# Altium schematic sheet 05_MCU.SchDoc: =TitleParameter
size A3; Organization: ASISGUARD; Address1: Kemalpasa, Kemalpasa Cd. No:290 D:292H, 35060 Bornova/Izmir/Turkey; SheetNumber: 5; SheetTotal: 6
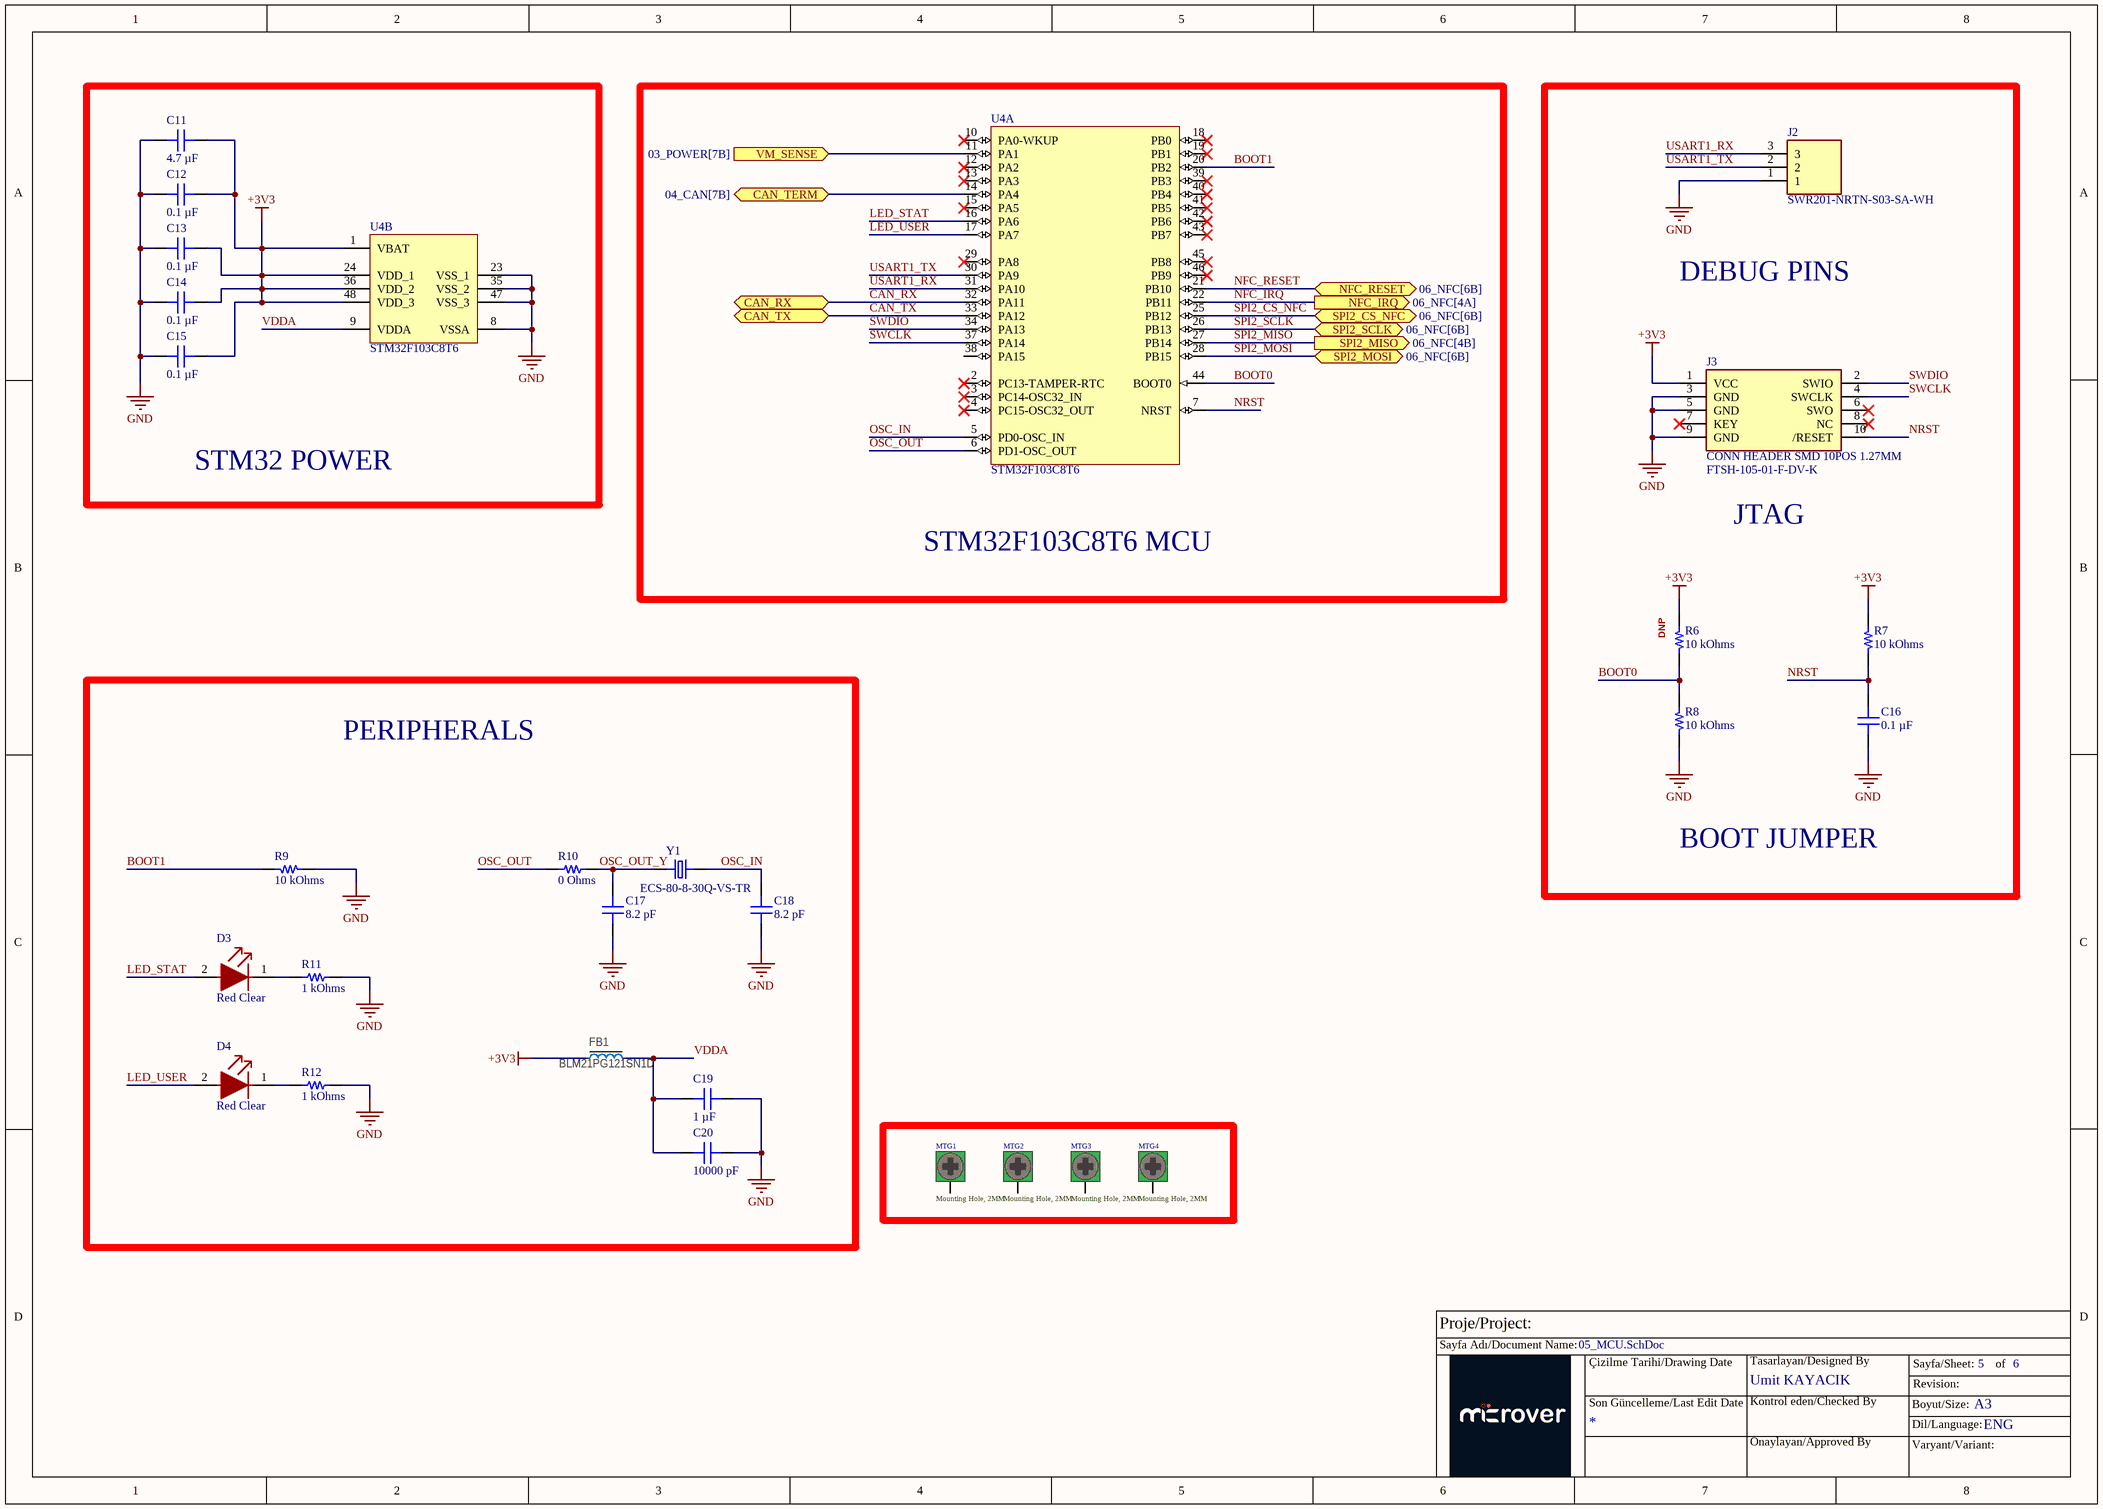
[diagram p0: 05_MCU.SchDoc]

## Parts
C11  4.7 µF  [CAP 0805_2012]
C12  Capacitance: 0.1 µF  [CAP 0603_1608]  (hidden comment: GCM188R71H104KA57J)
C13  Capacitance: 0.1 µF  [CAP 0603_1608]  (hidden comment: GCM188R71H104KA57J)
C14  Capacitance: 0.1 µF  [CAP 0603_1608]  (hidden comment: GCM188R71H104KA57J)
C15  Capacitance: 0.1 µF  [CAP 0603_1608]  (hidden comment: GCM188R71H104KA57J)
C16  Capacitance: 0.1 µF  [CAP 0603_1608]  (hidden comment: GCM188R71H104KA57J)
C17  8.2 pF  [CAP 0402_1005]
C18  8.2 pF  [CAP 0402_1005]
C19  1 µF  [CAP 0603_1608]
C20  10000 pF  [CAP 0603_1608]
D3  Color: Red Clear  [Lite-On_RED_0603]  (hidden comment: LED RED CLEAR SMD)
D4  Color: Red Clear  [Lite-On_RED_0603]  (hidden comment: LED RED CLEAR SMD)
FB1  BLM21PG121SN1D  [INDC2012X11L]
J2  SWR201-NRTN-S03-SA-WH  [SHDR3W50P0X200_1X3_790X460X630P]
J3  CONN HEADER SMD 10POS 1.27MM  [Samtec_0_MFG]
MTG1  Mounting Hole, 2MM  [MTG-PTH-2MM]  (no BOM)
MTG2  Mounting Hole, 2MM  [MTG-PTH-2MM]  (no BOM)
MTG3  Mounting Hole, 2MM  [MTG-PTH-2MM]  (no BOM)
MTG4  Mounting Hole, 2MM  [MTG-PTH-2MM]  (no BOM)
R6  10 kOhms  [RES 0402_1005]
R7  10 kOhms  [RES 0402_1005]
R8  10 kOhms  [RES 0402_1005]
R9  10 kOhms  [RES 0402_1005]
R10  0 Ohms  [RES 0402_1005]
R11  1 kOhms  [RES 0402_1005]
R12  1 kOhms  [RES 0402_1005]
U4  STM32F103C8T6  [LQFP48_STM]  (parts A,B of 2)
Y1  ECS-80-8-30Q-VS-TR  [XTAL_ECS-80-8-30Q-VS-TR]

## Blocks framed on the sheet
STM32 POWER: C11-C15 U4
STM32F103C8T6 MCU: U4
PERIPHERALS: C17-C20 D3 D4 FB1 R9-R12 Y1

## Ports
CAN_RX (bidir, see 04_CAN[2B]), CAN_TERM (bidir, see 04_CAN[7B]), CAN_TX (bidir, see 04_CAN[2B]), NFC_IRQ (out, see 06_NFC[4A]), NFC_RESET (bidir, see 06_NFC[6B]), SPI2_CS_NFC (bidir, see 06_NFC[6B]), SPI2_MISO (out, see 06_NFC[4B]), SPI2_MOSI (bidir, see 06_NFC[6B]), SPI2_SCLK (bidir, see 06_NFC[6B]), VM_SENSE (in, see 03_POWER[7B])

## Nets
+3V3: C11.2 C12.1 C13.1 C14.1 C15.1 FB1.1 J3.1(VCC) R6.1 R7.1 U4.1(VBAT) U4.24(VDD_1) U4.36(VDD_2) U4.48(VDD_3)
GND: C11.1 C12.2 C13.2 C14.2 C15.2 C16.2 C17.1 C18.1 C19.2 C20.2 J2.1 J3.3(GND) J3.5(GND) J3.9(GND) R8.2 R9.1 R11.2 R12.2 U4.8(VSSA) U4.23(VSS_1) U4.35(VSS_2) U4.47(VSS_3)
BOOT0: R6.2 R8.1 U4.44(BOOT0)
BOOT1: R9.2 U4.20(PB2)
CAN_RX: U4.32(PA11) ; port CAN_RX
CAN_TERM: U4.14(PA4) ; port CAN_TERM
CAN_TX: U4.33(PA12) ; port CAN_TX
LED_STAT: D3.2(A) U4.16(PA6)
LED_USER: D4.2(A) U4.17(PA7)
NFC_IRQ: U4.22(PB11) ; port NFC_IRQ
NFC_RESET: U4.21(PB10) ; port NFC_RESET
NRST: C16.1 J3.10(/RESET) R7.2 U4.7(NRST)
OSC_IN: C18.2 U4.5(PD0-OSC_IN) Y1.2(OUT/IN)
OSC_OUT: R10.1 U4.6(PD1-OSC_OUT)
OSC_OUT_Y: C17.2 R10.2 Y1.1(IN/OUT)
SPI2_CS_NFC: U4.25(PB12) ; port SPI2_CS_NFC
SPI2_MISO: U4.27(PB14) ; port SPI2_MISO
SPI2_MOSI: U4.28(PB15) ; port SPI2_MOSI
SPI2_SCLK: U4.26(PB13) ; port SPI2_SCLK
SWCLK: J3.4(SWCLK) U4.37(PA14)
SWDIO: J3.2(SWIO) U4.34(PA13)
USART1_RX: J2.3 U4.31(PA10)
USART1_TX: J2.2 U4.30(PA9)
VDDA: C19.1 C20.1 FB1.2 U4.9(VDDA)
VM_SENSE: U4.11(PA1) ; port VM_SENSE
NetD3_1: D3.1(C) R11.1
NetD4_1: D4.1(C) R12.1

Not connected (* = marked no-connect by the designer): J3 6(SWO)* 7(KEY)* 8(NC)*; MTG1 0; MTG2 0; MTG3 0; MTG4 0; U4 2(PC13-TAMPER-RTC)* 3(PC14-OSC32_IN)* 4(PC15-OSC32_OUT)* 10(PA0-WKUP)* 12(PA2)* 13(PA3)* 15(PA5)* 18(PB0)* 19(PB1)* 29(PA8)* 38(PA15) 39(PB3)* 40(PB4)* 41(PB5)* 42(PB6)* 43(PB7)* 45(PB8)* 46(PB9)*

## Notes on the sheet
- DEBUG PINS
- JTAG
- (near R6) DNP
- BOOT JUMPER
- Proje/Project:
- Sayfa Adı/Document Name:
- Çizilme Tarihi/Drawing Date
- Umit KAYACIK
- Tasarlayan/Designed By
- Sayfa/Sheet:
- Revision:
- of
- Son Güncelleme/Last Edit Date
- Kontrol eden/Checked By
- Onaylayan/Approved By
- Boyut/Size:
- Varyant/Variant:
- Dil/Language:
- A3
- ENG

## Library data of the parts
C11 = GRM21BZ71H475KE15K: CAP CER 4.7UF 50V X7R 0805; manufacturer: Murata Electronics; Tolerance: ±10%; Part Number: GRM21BZ71H475KE15K; Capacitance: 4.7 µF; Applications: General Purpose; componentlink1description: Datasheet; componentlink1url: https://search.murata.co.jp/Ceramy/image/img/A01X/G101/ENG/GRM21BZ71H475KE15-01.pdf; componentlink2description: DigiKey Link; componentlink2url: https://www.digikey.com/en/products/detail/murata-electronics/GRM21BZ71H475KE15K/13904908; Device Package: 0805 (2012 Metric); lastupdated: 6.04.2026 19:31:51; Lifecycle Status: Active; Minimum Order: 1; Mounting Type: Surface Mount, MLCC; Operating Temperature: -55°C ~ 125°C; Package / Case: 0805 (2012 Metric); packaging: TapeAndReel; partid: 39591; Part Status: Active; price: 0.17; series: GRM; Size / Dimension: 0.079" L x 0.049" W (2.00mm x 1.25mm); Supplier 1: DigiKey; Supplier Part Number 1: 490-GRM21BZ71H475KE15KCT-ND; Temperature Coefficient: X7R; Thickness (Max): 0.057" (1.45mm); value: 4.7 µF; Voltage - Rated: 50V
C12-C16 = GCM188R71H104KA57J: CAP CER 0.1UF 50V X7R 0603; manufacturer: Murata Electronics; Tolerance: ±10%; Part Number: GCM188R71H104KA57J; Applications: Automotive; componentlink1description: Datasheet; componentlink1url: https://psearch.en.murata.com/capacitor/product/GCM188R71H104KA57%23.pdf; componentlink2description: DigiKey Link; componentlink2url: https://www.digikey.com/en/products/detail/murata-electronics/GCM188R71H104KA57J/2591942; Device Package: 0603 (1608 Metric); lastupdated: 6.04.2026 19:22:36; Lifecycle Status: Active; Minimum Order: 1; Mounting Type: Surface Mount, MLCC; Operating Temperature: -55°C ~ 125°C; Package / Case: 0603 (1608 Metric); packaging: TapeAndReel; partid: 60442; Part Status: Not For New Designs; price: 0.03; Ratings: AEC-Q200; series: GCM; Size / Dimension: 0.063" L x 0.031" W (1.60mm x 0.80mm); Supplier 1: DigiKey; Supplier Part Number 1: 490-8020-1-ND; Temperature Coefficient: X7R; Thickness (Max): 0.035" (0.90mm); Voltage - Rated: 50V
C17 C18 = GMC04CG8R2J25NT: CAP0402 COG 8.2PF 5% 25V; manufacturer: Cal-Chip Electronics, Inc.; Temperature Coefficient: C0G, NP0; Part Number: GMC04CG8R2J25NT; Capacitance: 8.2 pF; Applications: General Purpose; componentlink1description: Datasheet; componentlink1url: https://calchip.com/wp-content/uploads/2025/05/GMC-Series-3.pdf; componentlink2description: DigiKey Link; componentlink2url: https://www.digikey.com/en/products/detail/cal-chip-electronics-inc/GMC04CG8R2J25NT/27784357; Device Package: 0402 (1005 Metric); Features: General Purpose; lastupdated: 6.04.2026 19:06:51; Lifecycle Status: Active; Minimum Order: 1; Mounting Type: Surface Mount, MLCC; Operating Temperature: -55°C ~ 125°C; Package / Case: 0402 (1005 Metric); packaging: TapeAndReel; partid: 61382; price: 0.07; series: GMC; Size / Dimension: 0.039" L x 0.020" W (1.00mm x 0.50mm); Supplier 1: DigiKey; Supplier Part Number 1: 4713-GMC04CG8R2J25NTCT-ND; Thickness (Max): 0.022" (0.55mm); Tolerance: ±5%; value: 8.2 pF; Voltage - Rated: 25V
C19 = GMC10X7R105K25NT: CAP0603 X7R 1UF 10% 25V; manufacturer: Cal-Chip Electronics, Inc.; Part Number: GMC10X7R105K25NT; Capacitance: 1 µF; Applications: General Purpose; componentlink1description: Datasheet; componentlink1url: https://calchip.com/wp-content/uploads/2023/05/gmc_series.pdf; componentlink2description: DigiKey Link; componentlink2url: https://www.digikey.com/en/products/detail/cal-chip-electronics-inc/GMC10X7R105K25NT/22461338; Device Package: 0603 (1608 Metric); lastupdated: 6.04.2026 19:18:33; Lifecycle Status: Active; Minimum Order: 1; Mounting Type: Surface Mount, MLCC; Operating Temperature: -55°C ~ 125°C; Package / Case: 0603 (1608 Metric); packaging: TapeAndReel; partid: 68086; price: 0.01; series: GMC; Size / Dimension: 0.063" L x 0.031" W (1.60mm x 0.80mm); Supplier 1: DigiKey; Supplier Part Number 1: 4713-GMC10X7R105K25NTCT-ND; Temperature Coefficient: X7R; Thickness (Max): 0.037" (0.95mm); Tolerance: ±10%; value: 1 µF; Voltage - Rated: 25V
C20 = C0603C103K4RECTU: CAP CER 0603 10NF 16V X7R 10%; manufacturer: KEMET; Part Number: C0603C103K4RECTU; Capacitance: 10000 pF; Applications: ESD Protection; componentlink1description: Datasheet; componentlink1url: https://search.kemet.com/download/datasheet/C0603C103K4REC7867; componentlink2description: DigiKey Link; componentlink2url: https://www.digikey.com/en/products/detail/kemet/C0603C103K4RECTU/8643658; Device Package: 0603 (1608 Metric); lastupdated: 6.04.2026 19:17:55; Lifecycle Status: Active; Minimum Order: 1; Mounting Type: Surface Mount, MLCC; Operating Temperature: -55°C ~ 125°C; Package / Case: 0603 (1608 Metric); packaging: TapeAndReel; partid: 66152; price: 0.01; series: ESD SMD Comm X7R; Size / Dimension: 0.063" L x 0.031" W (1.60mm x 0.80mm); Supplier 1: DigiKey; Supplier Part Number 1: 399-C0603C103K4RECTUCT-ND; Temperature Coefficient: X7R; Thickness (Max): 0.034" (0.87mm); Tolerance: ±10%; value: 10000 pF; Voltage - Rated: 16V
D3 D4 = LTST-C191KRKT_2: Red 631nm LED Indication - Discrete 2V 0603 (1608 Metric); Manufacturer: Lite-On Inc.; Order Code: DIGI: 160-1447-2-ND; Manufacturer Part Number: LTST-C191KRKT
FB1 = FB0402-120R@100M-500mA: Ferrite Bead, 120 Ohm @ 100MHz, 500mA, 250 mOhm Max; Manufacturer: Murata; Manufacturer Part Number: BLM15AG121SN1D; Part number IPS: 00000009954; Part number Norautron: 265230631; Part number NEMS: 100300099; Value: 120R/0.55A; Note: Chip EMIFIL Inductor Type Chip Ferrite Bead; Artikkelnr Noca: 33029317; Pad Count: 2; Component Status: Active; Part Number: FB0402-120R@100M-500mA; Footprint Doc: 0402; LatestRevisionDate: 2014-01-10; Published: 2011-11-14; ComponentLink1Description: Datasheet; ComponentLink2Description: Supplier link; ComponentLink1URL: N.A.; ComponentLink2URL: N.A.; HelpURL: http://search.murata.co.jp/Ceramy/image/img/PDF/ENG/L0110S0100BLM15A_SN.pdf; Supplier 1: Digi-Key; Supplier Part Number 1: 490-1005-1-ND; Supplier 2: Farnell; Supplier Part Number 2: 151-5760; Component Class: Inductors; PartId: 100300099; Author: rsk
J2 = SWR201-NRTN-S03-SA-WH: Connector; Manufacturer_Name: Sullins; Datasheet Link: https://drawings-pdf.s3.amazonaws.com/11623.pdf; Height: 6.3mm; Manufacturer_Part_Number: SWR201-NRTN-S03-SA-WH
J3 = FTSH-105-01-F-DV-K: Connector Header Surface Mount 10 position 0.050" (1.27mm); Order Code: DIGI: SAM8796-ND; Manufacturer Part Number: FTSH-105-01-F-DV-K
MTG1-MTG4 = MTG2MM
R6-R9 = RMCF0402FT10K0: RES 10K OHM 1% 1/16W 0402; Manufacturer: Stackpole Electronics Inc; Power (Watts): 0.063W, 1/16W; Temperature Coefficient: ±100ppm/°C; Part Number: RMCF0402FT10K0; Value: 10 kOhms; ComponentLink1Description: Datasheet; ComponentLink1URL: https://www.seielect.com/catalog/sei-rmcf_rmcp.pdf; ComponentLink2Description: DigiKey Link; ComponentLink2URL: https://www.digikey.com/en/products/detail/stackpole-electronics-inc/RMCF0402FT10K0/1761433; Composition: Thick Film; Device Package: 0402 (1005 Metric); Features: Automotive AEC-Q200; Height - Seated (Max): 0.016" (0.40mm); LastUpdated: 9.02.2024 20:29:20; Lifecycle Status: Active; Minimum Order: 1; Number of Terminations: 2; Operating Temperature: -55°C ~ 155°C; Package / Case: 0402 (1005 Metric); Packaging: CutTape; PartId: 20541; Part Status: Active; Price: 0.01; Ratings: AEC-Q200; Resistance: 10 kOhms; Series: RMCF; Size / Dimension: 0.039" L x 0.020" W (1.00mm x 0.50mm); Supplier 1: DigiKey; Supplier Part Number 1: RMCF0402FT10K0CT-ND; Supplier Device Package: 0402; Tolerance: ±1%
R10 = RMCF0402ZT0R00: RES 0 OHM JUMPER 1/16W 0402; Manufacturer: Stackpole Electronics Inc; Power (Watts): 0.063W, 1/16W; Part Number: RMCF0402ZT0R00; Value: 0 Ohms; ComponentLink1Description: Datasheet; ComponentLink1URL: https://www.seielect.com/catalog/sei-rmcf_rmcp.pdf; ComponentLink2Description: DigiKey Link; ComponentLink2URL: https://www.digikey.com/en/products/detail/stackpole-electronics-inc/RMCF0402ZT0R00/1756905; Composition: Thick Film; Device Package: 0402 (1005 Metric); Features: Automotive AEC-Q200; Height - Seated (Max): 0.016" (0.40mm); LastUpdated: 9.02.2024 20:29:34; Lifecycle Status: Active; Minimum Order: 1; Number of Terminations: 2; Operating Temperature: -55°C ~ 155°C; Package / Case: 0402 (1005 Metric); Packaging: CutTape; PartId: 17627; Part Status: Active; Price: 0.01; Ratings: AEC-Q200; Resistance: 0 Ohms; Series: RMCF; Size / Dimension: 0.039" L x 0.020" W (1.00mm x 0.50mm); Supplier 1: DigiKey; Supplier Part Number 1: RMCF0402ZT0R00CT-ND; Supplier Device Package: 0402; Tolerance: Jumper
R11 R12 = RMCF0402FT1K00: RES 1K OHM 1% 1/16W 0402; Manufacturer: Stackpole Electronics Inc; Power (Watts): 0.063W, 1/16W; Temperature Coefficient: ±100ppm/°C; Part Number: RMCF0402FT1K00; Value: 1 kOhms; ComponentLink1Description: Datasheet; ComponentLink1URL: https://www.seielect.com/catalog/sei-rmcf_rmcp.pdf; ComponentLink2Description: DigiKey Link; ComponentLink2URL: https://www.digikey.com/en/products/detail/stackpole-electronics-inc/RMCF0402FT1K00/1761754; Composition: Thick Film; Device Package: 0402 (1005 Metric); Features: Automotive AEC-Q200; Height - Seated (Max): 0.016" (0.40mm); LastUpdated: 9.02.2024 20:29:20; Lifecycle Status: Active; Minimum Order: 1; Number of Terminations: 2; Operating Temperature: -55°C ~ 155°C; Package / Case: 0402 (1005 Metric); Packaging: CutTape; PartId: 20544; Part Status: Active; Price: 0.01; Ratings: AEC-Q200; Resistance: 1 kOhms; Series: RMCF; Size / Dimension: 0.039" L x 0.020" W (1.00mm x 0.50mm); Supplier 1: DigiKey; Supplier Part Number 1: RMCF0402FT1K00CT-ND; Supplier Device Package: 0402; Tolerance: ±1%
U4 = STM32F103C8T6: ARM Cortex-M3 32-bit MCU, 64 KB Flash, 20 KB Internal RAM, 37 I/Os, 48-pin LQFP, -40 to 85 degC, Tray; Operating Frequency(F) (Processor speed) (MHz): 72; Supply Voltage(Vcc) min (V): 2; FLASH Size (Prog) (kB): 64; Internal RAM Size (kB): 20; I/Os (High Current): 37; A/D Converter: 2x12-bit (10 Channel); Core: ARM Cortex-M3; ComponentLink2Description: Datasheet; ComponentLink3Description: Package Specification; Mounting Technology: Surface Mount; ComponentLink3URL: http://www.st.com/st-web-ui/static/active/en/resource/technical/document/datasheet/DM00058181.pdf; DatasheetVersion: Rev. 16; ComponentLink1URL: http://www.st.com/web/en/home.html; ComponentLink1Description: Manufacturer URL; Manufacturer Part Number: STM32F103C8T6; Packing: Tray; PackageVersion: Rev. 6, 06/2013; PackageReference: LQFP48; PackageDescription: 48-Pin Low Profile Quad Flat Package, 7 x 7 mm Body, 0.5 mm Pitch; ComponentLink2URL: http://www.st.com/st-web-ui/static/active/en/resource/technical/document/datasheet/CD00161566.pdf; LCSC Part Number: C8734; LCSC Manufacturer Part Number: STM32F103C8T6
Y1 = ECS-80-8-30Q-VS-TR: 8 MHz Â±30ppm Crystal 8pF 100 Ohms 2-SMD, No Lead; MF: ECS Inc.; SnapEDA_Link: https://www.snapeda.com/parts/ECS-80-8-30Q-VS-TR/ECS/view-part/?ref=snap; Package: SMD-2 ECS Inc.; Value: *; MP: ECS-80-8-30Q-VS-TR; Check_prices: https://www.snapeda.com/parts/ECS-80-8-30Q-VS-TR/ECS/view-part/?ref=eda